# Altium project MB_SAUVC26.PrjPcb
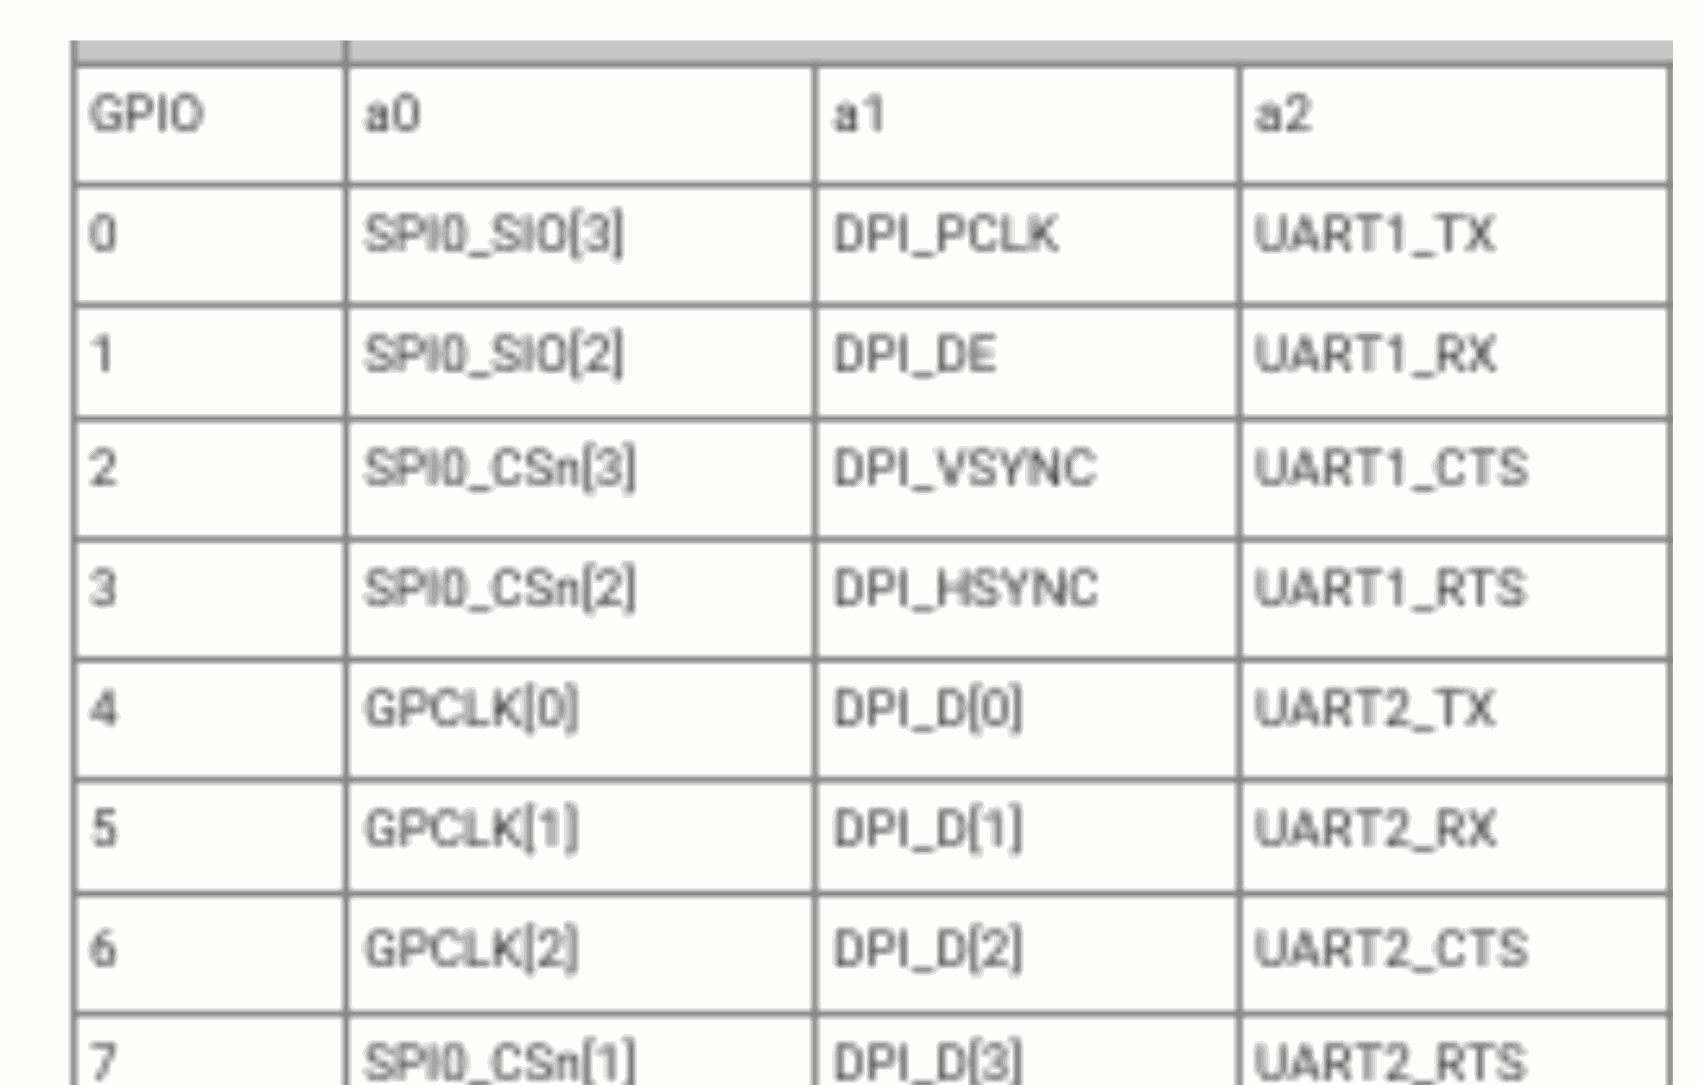
[diagram p0: Sheet1.SchDoc, top left]
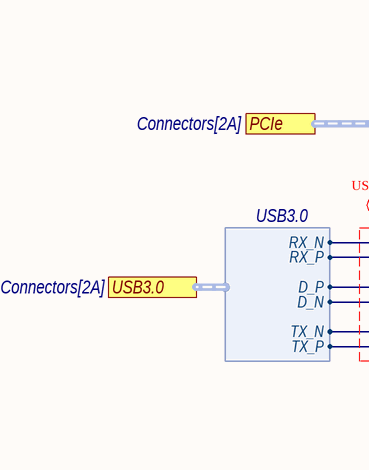
[diagram p1: Sheet1.SchDoc, top middle]
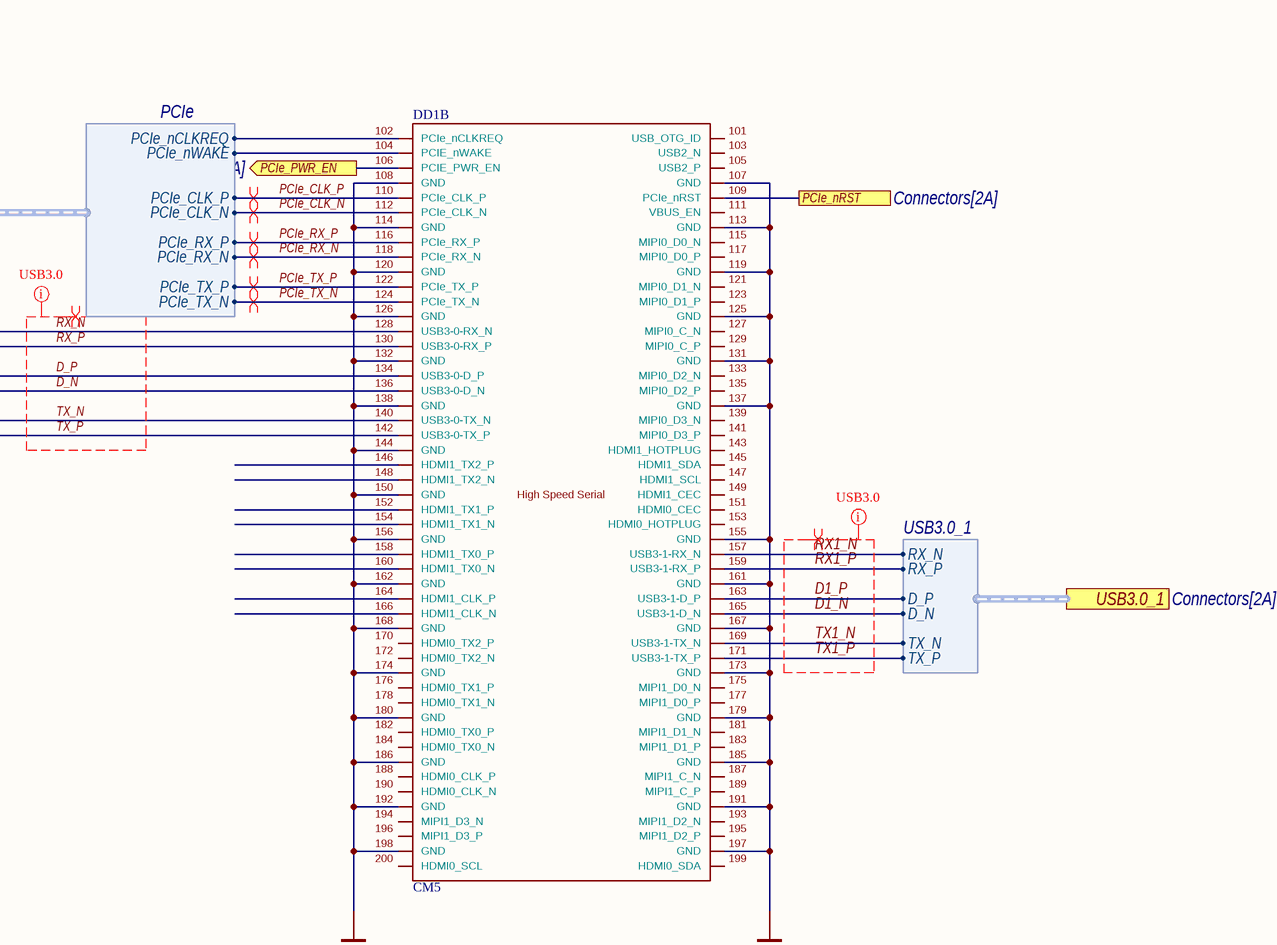
[diagram p2: Sheet1.SchDoc, top right]
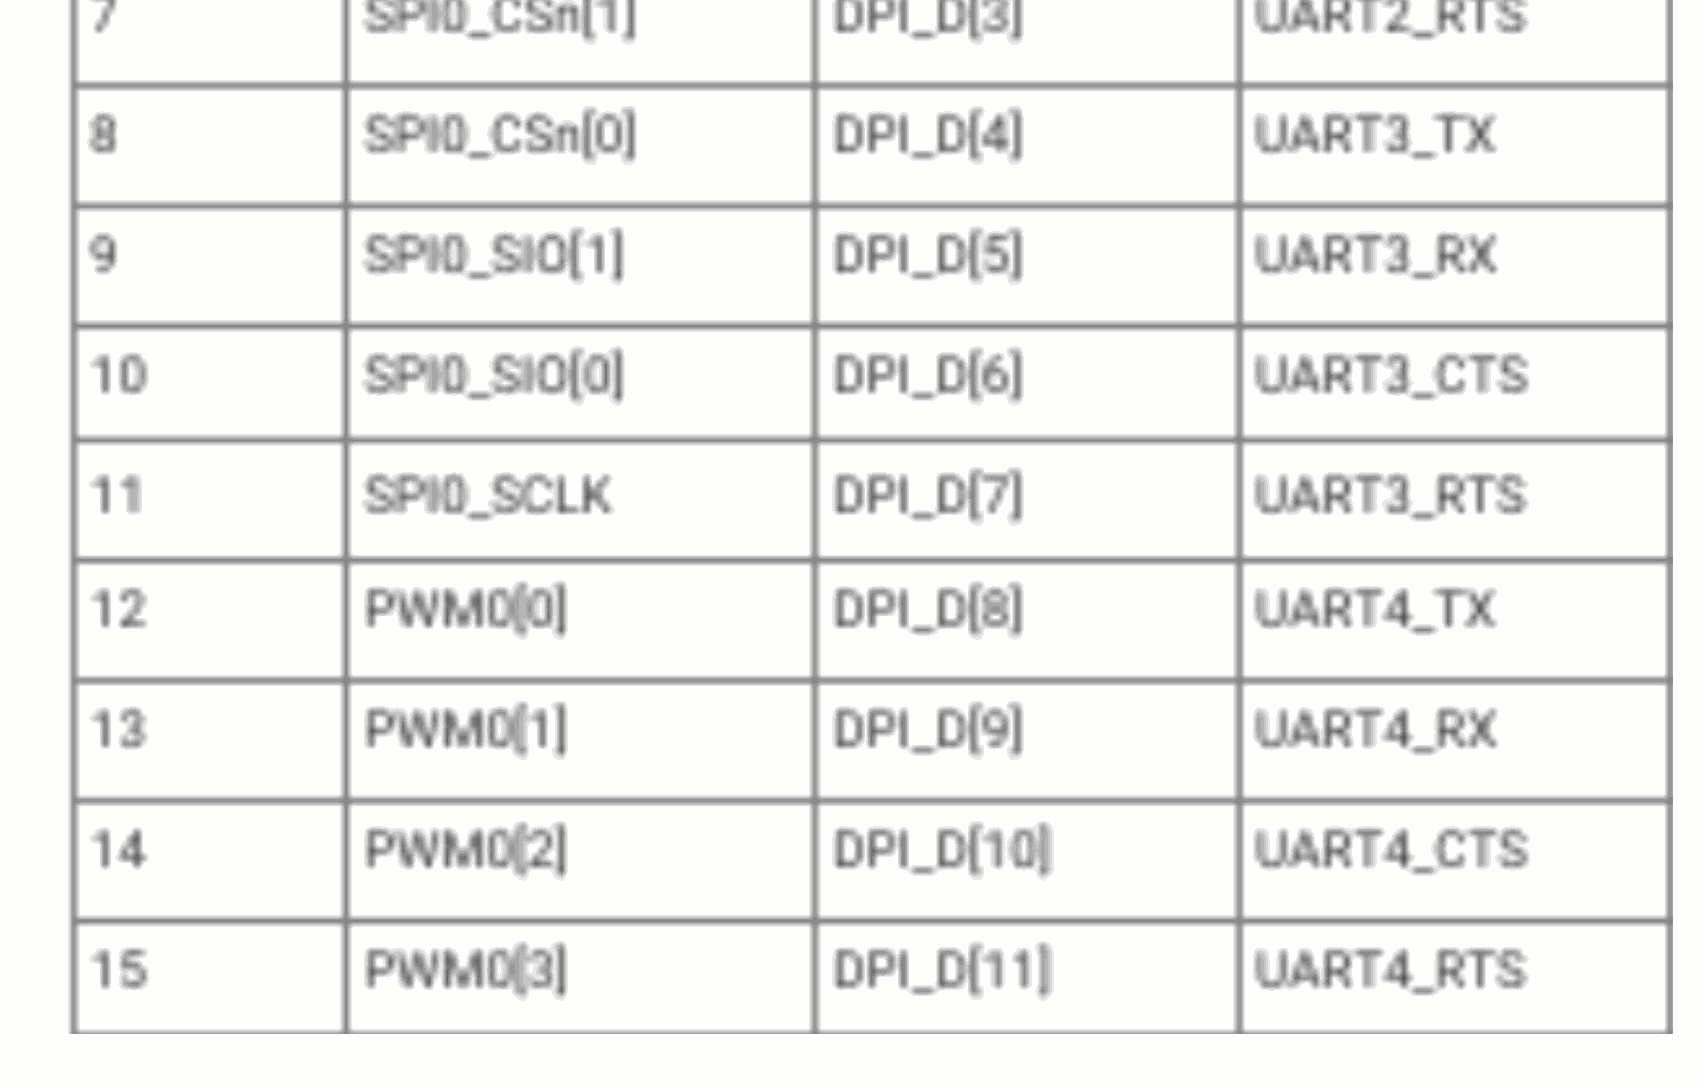
[diagram p3: Sheet1.SchDoc, bottom left]
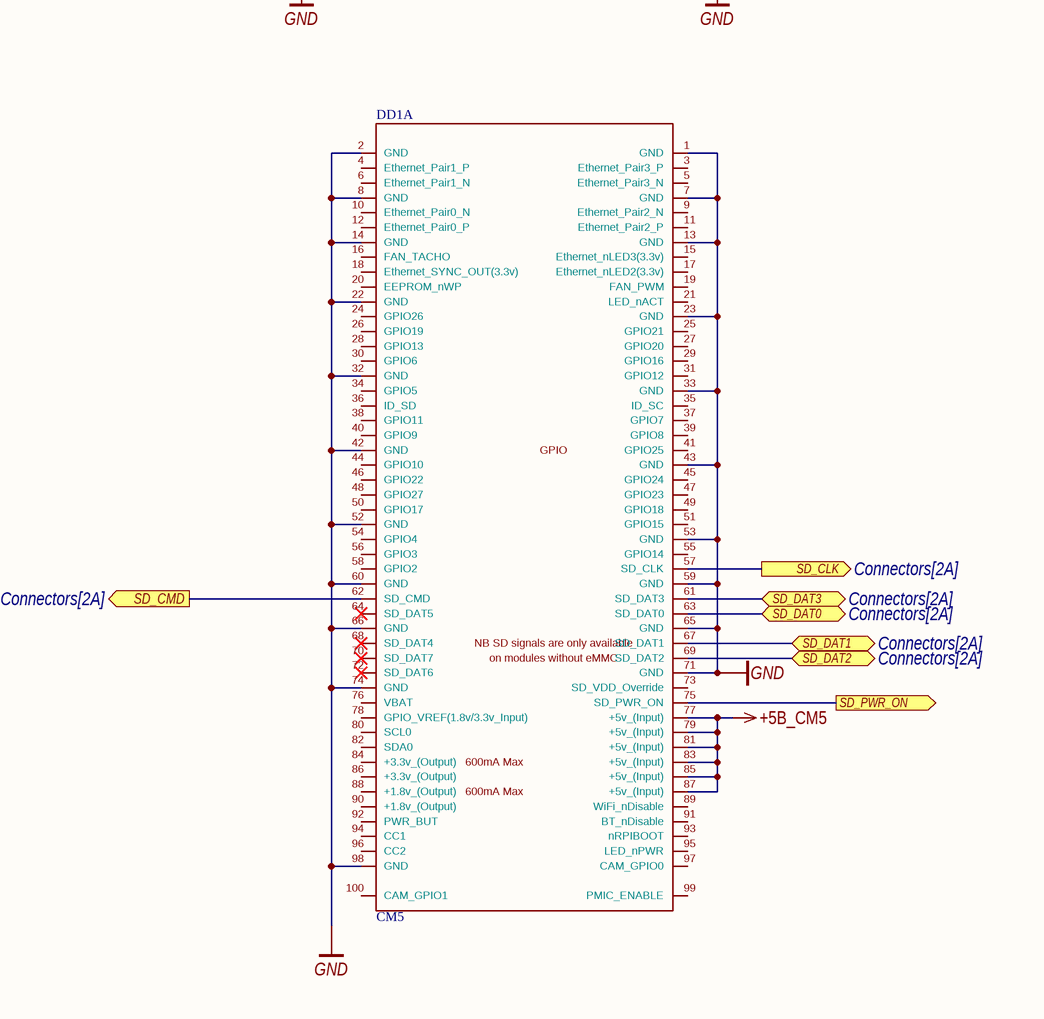
[diagram p4: Sheet1.SchDoc, bottom right]
Decimal_Number_PCB: ГИДР.123456.010; Decimal_Number_Shematic: ГИДР.123456.011; DrawnBy: Булатов и ко; Release_Date: 29.07.2025; Title: Материнская плата аппарата НеоВельт; Version: 03
4 sheets, 17 parts. Net scope: flat (ports and power ports of the same name join across sheets).
Board file: 4 layers.PcbDoc
Sheets:
  Sheet1.SchDoc
  Power.SchDoc
  ETH_SWITCH.SchDoc
  Connectors.SchDoc

## Sheet Sheet1.SchDoc: Материнская плата аппарата НеоВельт
size 594 x 420 mm; PageSetup: Record=PageOptions|CenterHorizontal=True|CenterVertical=True|PrintScale=0.94|XCorrection=1.00|YCorrection=1.00|PrintKind=1|BorderSize=5000000|LeftOffset=0|BottomOffset=0|Orientation=1|PaperLength=1000|PaperWidth=1000|Scale=100|PaperSource=7|PrintQuality=-4|MediaType=1|DitherType=10|PaperKind=A4|PrintScaleMode=1; Address1: Address1; Address2: Address2; Address3: Address3; Address4: Address4; DocumentNumber: 1; SheetNumber: 1; SheetTotal: 5

### Parts
DD1  CM5  [CM4-DF40HC(3.0)-100DS-0.4v_3mm_1.5mm]  (parts A,B of 2)

### Ports
PCIe (harness PCIe, see Connectors[2A]), PCIe_nRST (see Connectors[2A]), PCIe_PWR_EN (out, see Power[2A]), SD_CLK (out, see Connectors[2A]), SD_CMD (out, see Connectors[2A]), SD_DAT0 (bidir, see Connectors[2A]), SD_DAT1 (bidir, see Connectors[2A]), SD_DAT2 (bidir, see Connectors[2A]), SD_DAT3 (bidir, see Connectors[2A]), SD_PWR_ON (out), USB3.0 (harness USB3.0, see Connectors[2A]), USB3.0_1 (harness USB3.0_1, see Connectors[2A])

### Harnesses
USB3.0: RX_N, RX_P, D_P, D_N, TX_N, TX_P
USB3.0_1: RX_N, RX_P, D_P, D_N, TX_N, TX_P
PCIe: PCIe_nCLKREQ, PCIe_nWAKE, PCIe_CLK_P, PCIe_CLK_N, PCIe_RX_P, PCIe_RX_N, PCIe_TX_P, PCIe_TX_N

### Nets
+5В_CM5: DD1.77(+5v_(Input)) DD1.79(+5v_(Input)) DD1.81(+5v_(Input)) DD1.83(+5v_(Input)) DD1.85(+5v_(Input)) DD1.87(+5v_(Input))
GND: DD1.1(GND) DD1.2(GND) DD1.7(GND) DD1.8(GND) DD1.13(GND) DD1.14(GND) DD1.22(GND) DD1.23(GND) DD1.32(GND) DD1.33(GND) DD1.42(GND) DD1.43(GND) DD1.52(GND) DD1.53(GND) DD1.59(GND) DD1.60(GND) DD1.65(GND) DD1.66(GND) DD1.71(GND) DD1.74(GND) DD1.98(GND) DD1.107(GND) DD1.108(GND) DD1.113(GND) DD1.114(GND) DD1.119(GND) DD1.120(GND) DD1.125(GND) DD1.126(GND) DD1.131(GND) DD1.132(GND) DD1.137(GND) DD1.138(GND) DD1.144(GND) DD1.150(GND) DD1.155(GND) DD1.156(GND) DD1.161(GND) DD1.162(GND) DD1.167(GND) DD1.168(GND) DD1.173(GND) DD1.174(GND) DD1.179(GND) DD1.180(GND) DD1.185(GND) DD1.186(GND) DD1.191(GND) DD1.192(GND) DD1.197(GND) DD1.198(GND)
D1_N: DD1.165(USB3-1-D_N) ; port USB3.0_1.D_N
D1_P: DD1.163(USB3-1-D_P) ; port USB3.0_1.D_P
D_N: DD1.136(USB3-0-D_N) ; port USB3.0.D_N
D_P: DD1.134(USB3-0-D_P) ; port USB3.0.D_P
PCIe_CLK_N: DD1.112(PCIe_CLK_N) ; port PCIe.PCIe_CLK_N
PCIe_CLK_P: DD1.110(PCIe_CLK_P) ; port PCIe.PCIe_CLK_P
PCIe_RX_N: DD1.118(PCIe_RX_N) ; port PCIe.PCIe_RX_N
PCIe_RX_P: DD1.116(PCIe_RX_P) ; port PCIe.PCIe_RX_P
PCIe_TX_N: DD1.124(PCIe_TX_N) ; port PCIe.PCIe_TX_N
PCIe_TX_P: DD1.122(PCIe_TX_P) ; port PCIe.PCIe_TX_P
RX1_N: DD1.157(USB3-1-RX_N) ; port USB3.0_1.RX_N
RX1_P: DD1.159(USB3-1-RX_P) ; port USB3.0_1.RX_P
RX_N: DD1.128(USB3-0-RX_N) ; port USB3.0.RX_N
RX_P: DD1.130(USB3-0-RX_P) ; port USB3.0.RX_P
TX1_N: DD1.169(USB3-1-TX_N) ; port USB3.0_1.TX_N
TX1_P: DD1.171(USB3-1-TX_P) ; port USB3.0_1.TX_P
TX_N: DD1.140(USB3-0-TX_N) ; port USB3.0.TX_N
TX_P: DD1.142(USB3-0-TX_P) ; port USB3.0.TX_P
NetDD1_57: DD1.57(SD_CLK) ; port SD_CLK
NetDD1_61: DD1.61(SD_DAT3) ; port SD_DAT3
NetDD1_62: DD1.62(SD_CMD) ; port SD_CMD
NetDD1_63: DD1.63(SD_DAT0) ; port SD_DAT0
NetDD1_67: DD1.67(SD_DAT1) ; port SD_DAT1
NetDD1_69: DD1.69(SD_DAT2) ; port SD_DAT2
NetDD1_75: DD1.75(SD_PWR_ON) ; port SD_PWR_ON
NetDD1_102: DD1.102(PCIe_nCLKREQ) ; port PCIe.PCIe_nCLKREQ
NetDD1_104: DD1.104(PCIE_nWAKE) ; port PCIe.PCIe_nWAKE
NetDD1_106: DD1.106(PCIE_PWR_EN) ; port PCIe_PWR_EN
NetDD1_109: DD1.109(PCIe_nRST) ; port PCIe_nRST

Not connected (* = marked no-connect by the designer): DD1 3(Ethernet_Pair3_P) 4(Ethernet_Pair1_P) 5(Ethernet_Pair3_N) 6(Ethernet_Pair1_N) 9(Ethernet_Pair2_N) 10(Ethernet_Pair0_N) 11(Ethernet_Pair2_P) 12(Ethernet_Pair0_P) 15(Ethernet_nLED3(3.3v)) 16(FAN_TACHO) 17(Ethernet_nLED2(3.3v)) 18(Ethernet_SYNC_OUT(3.3v)) 19(FAN_PWM) 20(EEPROM_nWP) 21(LED_nACT) 24(GPIO26) 25(GPIO21) 26(GPIO19) 27(GPIO20) 28(GPIO13) 29(GPIO16) 30(GPIO6) 31(GPIO12) 34(GPIO5) 35(ID_SC) 36(ID_SD) 37(GPIO7) 38(GPIO11) 39(GPIO8) 40(GPIO9) 41(GPIO25) 44(GPIO10) 45(GPIO24) 46(GPIO22) 47(GPIO23) 48(GPIO27) 49(GPIO18) 50(GPIO17) 51(GPIO15) 54(GPIO4) 55(GPIO14) 56(GPIO3) 58(GPIO2) 64(SD_DAT5)* 68(SD_DAT4)* 70(SD_DAT7)* 72(SD_DAT6)* 73(SD_VDD_Override) 76(VBAT) 78(GPIO_VREF(1.8v/3.3v_Input)) 80(SCL0) 82(SDA0) 84(+3.3v_(Output)) 86(+3.3v_(Output)) 88(+1.8v_(Output)) 89(WiFi_nDisable) 90(+1.8v_(Output)) 91(BT_nDisable) 92(PWR_BUT) 93(nRPIBOOT) 94(CC1) 95(LED_nPWR) 96(CC2) 97(CAM_GPIO0) 99(PMIC_ENABLE) 100(CAM_GPIO1) 101(USB_OTG_ID) 103(USB2_N) 105(USB2_P) 111(VBUS_EN) 115(MIPI0_D0_N) 117(MIPI0_D0_P) 121(MIPI0_D1_N) 123(MIPI0_D1_P) 127(MIPI0_C_N) 129(MIPI0_C_P) 133(MIPI0_D2_N) 135(MIPI0_D2_P) 139(MIPI0_D3_N) 141(MIPI0_D3_P) 143(HDMI1_HOTPLUG) 145(HDMI1_SDA) 146(HDMI1_TX2_P) 147(HDMI1_SCL) 148(HDMI1_TX2_N) 149(HDMI1_CEC) 151(HDMI0_CEC) 152(HDMI1_TX1_P) 153(HDMI0_HOTPLUG) 154(HDMI1_TX1_N) 158(HDMI1_TX0_P) 160(HDMI1_TX0_N) 164(HDMI1_CLK_P) 166(HDMI1_CLK_N) 170(HDMI0_TX2_P) 172(HDMI0_TX2_N) 175(MIPI1_D0_N) 176(HDMI0_TX1_P) 177(MIPI1_D0_P) 178(HDMI0_TX1_N) 181(MIPI1_D1_N) 182(HDMI0_TX0_P) 183(MIPI1_D1_P) 184(HDMI0_TX0_N) 187(MIPI1_C_N) 188(HDMI0_CLK_P) 189(MIPI1_C_P) 190(HDMI0_CLK_N) 193(MIPI1_D2_N) 194(MIPI1_D3_N) 195(MIPI1_D2_P) 196(MIPI1_D3_P) 199(HDMI0_SDA) 200(HDMI0_SCL)

### Layout directives
differential pair: D1_N, D1_P, D_N, D_P, PCIe_CLK_N, PCIe_CLK_P, PCIe_RX_N, PCIe_RX_P, PCIe_TX_N, PCIe_TX_P, RX1_N, RX1_P, RX_N, RX_P, TX1_N, TX1_P, TX_N, TX_P
net class USB3.0; Impedance: 90 Ohm: D1_N, D1_P, D_N, D_P, RX1_N, RX1_P, RX_N, RX_P, TX1_N, TX1_P, TX_N, TX_P

### Notes on the sheet
- Перв. примен.
- Справ. №
- Подп. и дата
- Инв. № дубл.
- Взам. инв. №
- Инв. № подл.
- Изм.
- Лист
- № докум.
- Подп.
- Дата
- Копировал
- Формат А2
- (in symbol CM5, part A) GPIO; NB SD signals are only available; on modules without eMMC; 600mA Max
- (in symbol CM5, part B) High Speed Serial

### Library data of the parts
DD1 = CM5: Part Number: CM5

## Sheet Power.SchDoc: Материнская плата аппарата НеоВельт
size 420 x 297 mm; PageSetup: Record=PageOptions|CenterHorizontal=True|CenterVertical=True|PrintScale=0.94|XCorrection=1.00|YCorrection=1.00|PrintKind=1|BorderSize=5000000|LeftOffset=0|BottomOffset=0|Orientation=1|PaperLength=1000|PaperWidth=1000|Scale=100|PaperSource=7|PrintQuality=-4|MediaType=1|DitherType=10|PaperKind=A4|PrintScaleMode=1; Address1: Address1; Address2: Address2; Address3: Address3; Address4: Address4; DocumentNumber: 2; SheetNumber: 2; SheetTotal: 5
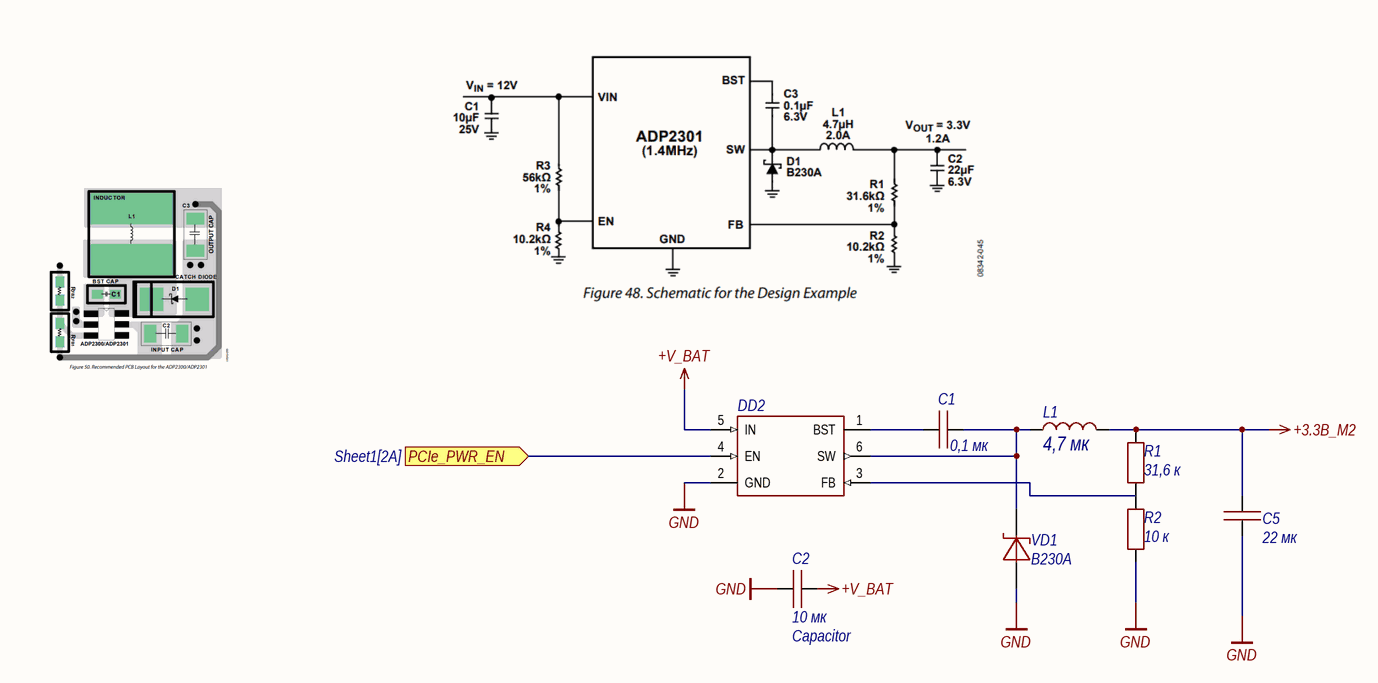
[diagram p5: Power.SchDoc]

### Parts
C1  value 0,1 мк  [0603C]  (hidden comment: Capacitor)
C2  Capacitor  value 10 мк  [1210C]
C5  value 22 мк  [1210C]  (hidden comment: Capacitor)
DD2  Повышающий DC-DC преобразователь 2А 1.2МГц  (value not drawn)
L1  value 4,7 мк  [IHLP-2525]  (hidden comment: IHLP2525CZER4R7M01)
R1  value 31,6 к  [0603R]  (hidden comment: Resistor)
R2  value 10 к  [0603R]  (hidden comment: Resistor)
VD1  B230A  [SMA]

### Ports
PCIe_PWR_EN (in, see Sheet1[2A])

### Nets
+3.3В_M2: C5.2 L1.2 R1.1
+V_BAT: C2.2 DD2.5(IN)
GND: C2.1 C5.1 DD2.2(GND) R2.1 VD1.1
NetC1_1: C1.1 DD2.1(BST)
NetC1_2: C1.2 DD2.6(SW) L1.1 VD1.2
NetDD1_106: DD2.4(EN) ; port PCIe_PWR_EN
NetDD2_3: DD2.3(FB) R1.2 R2.2

### Notes on the sheet
- Перв. примен.
- Справ. №
- Подп. и дата
- Инв. № дубл.
- Взам. инв. №
- Инв. № подл.
- Изм.
- Лист
- № докум.
- Подп.
- Дата
- Копировал
- Формат А3

### Library data of the parts
C1 = Capacitor_0,1u_10_50V_X7R_0603C: Конденсатор; Library Path2: Schematic\Capacitor.SchLib; Tolerance: 0,1; Voltage (V): 50; Dielectric: X7R; Capacity (nF): 100; Part Number: Capacitor_0,1u_10_50V_X7R_0603C
C2 = Capacitor_10u_10_35V_X7R_1210C: Конденсатор; Library Path2: Schematic\Capacitor.SchLib; Tolerance: 0,1; Voltage (V): 35; Dielectric: X7R; Capacity (nF): 10000; Part Number: Capacitor_10u_10_35V_X7R_1210C
C5 = Capacitor_22u_10_25V_X7R_1210C: Конденсатор; Library Path2: Schematic\Capacitor.SchLib; Tolerance: 0,1; Voltage (V): 25; Dielectric: X7R; Capacity (nF): 22000; Part Number: Capacitor_22u_10_25V_X7R_1210C
DD2 = ADP2300
L1 = IHLP2525CZER4R7M01: ЧИП-индуктивность экранированная 4,7мкГн ±20% 5,5A 40мОм 2525; Inductance (μH): 4,7; Current (A): 5,5; Part Number: IHLP2525CZER4R7M01
R1 = Resistor_31.6k_1_0603: Резистор номиналом 31,6 кОм и точностью 1%; Power: *; Part Number: Resistor_31.6k_1_0603; Tolerance: 1%
R2 = Resistor_10k_1_0603: Резистор номиналом 10 кОм и точностью 1%; Power: *; Part Number: Resistor_10k_1_0603; Tolerance: 1%
VD1 = 15MQ040N: Диод шоттки на 40 В, ном. ток 2.1 А; Voltage nominal (V): 40; Current (A): 2.1; Part Number: 15MQ040N

## Sheet ETH_SWITCH.SchDoc: Материнская плата аппарата НеоВельт
size 594 x 420 mm; PageSetup: Record=PageOptions|CenterHorizontal=True|CenterVertical=True|PrintScale=0.94|XCorrection=1.00|YCorrection=1.00|PrintKind=1|BorderSize=5000000|LeftOffset=0|BottomOffset=0|Orientation=1|PaperLength=1000|PaperWidth=1000|Scale=100|PaperSource=7|PrintQuality=-4|MediaType=1|DitherType=10|PaperKind=A4|PrintScaleMode=1; Address1: Address1; Address2: Address2; Address3: Address3; Address4: Address4; DocumentNumber: 3; SheetNumber: 3; SheetTotal: 5
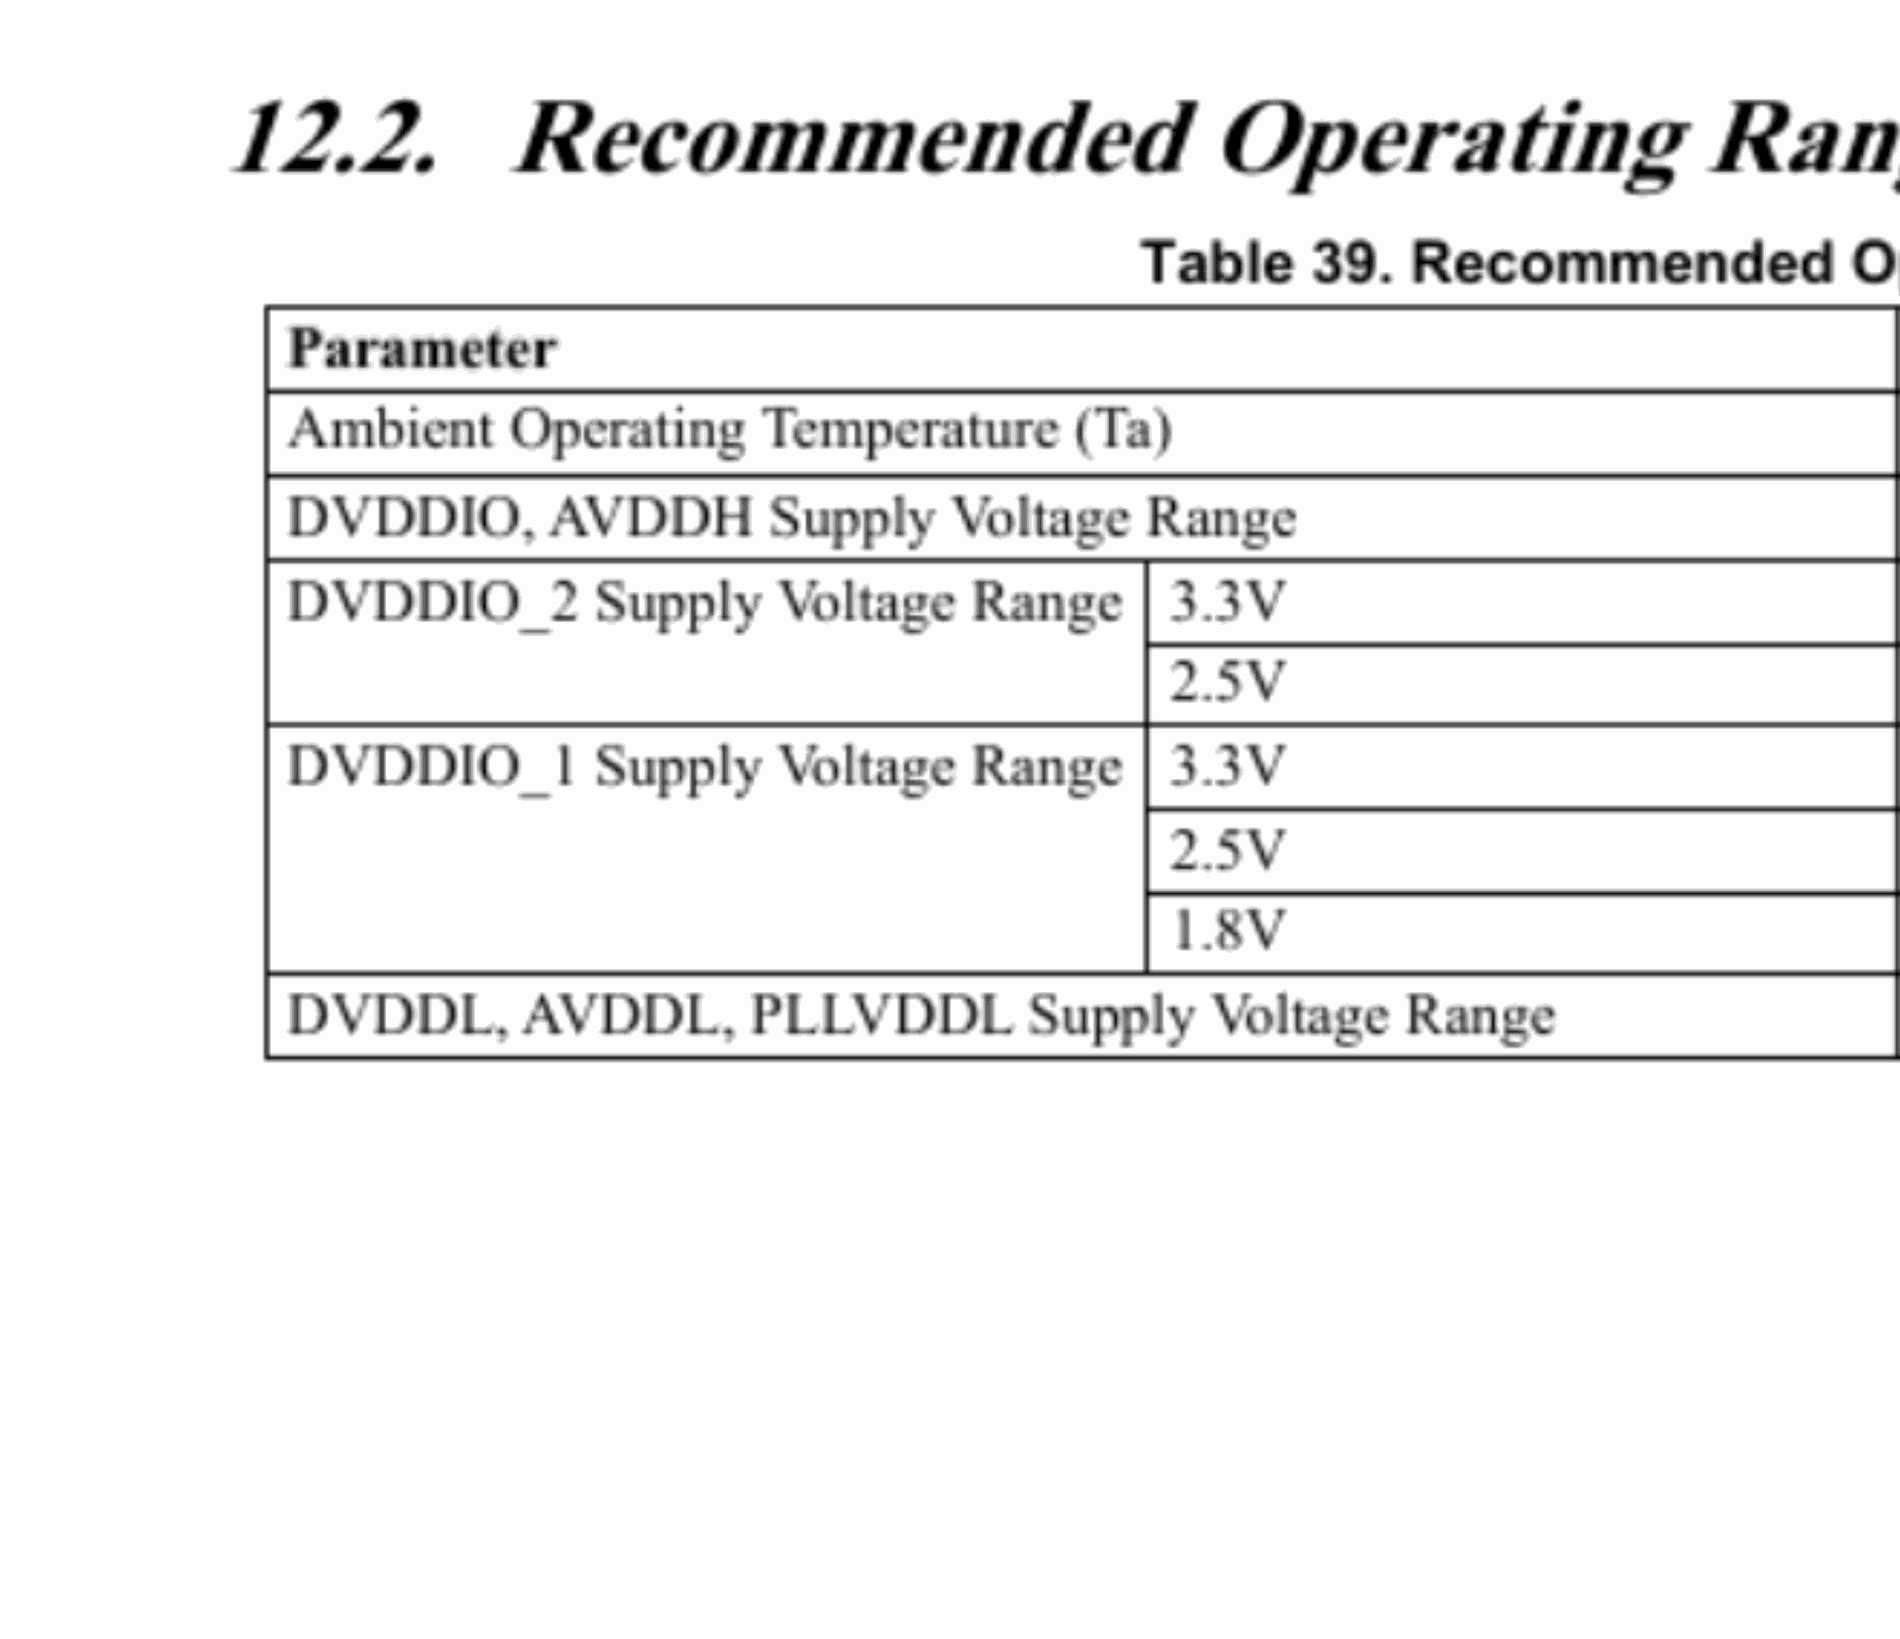
[diagram p6: ETH_SWITCH.SchDoc, top left]
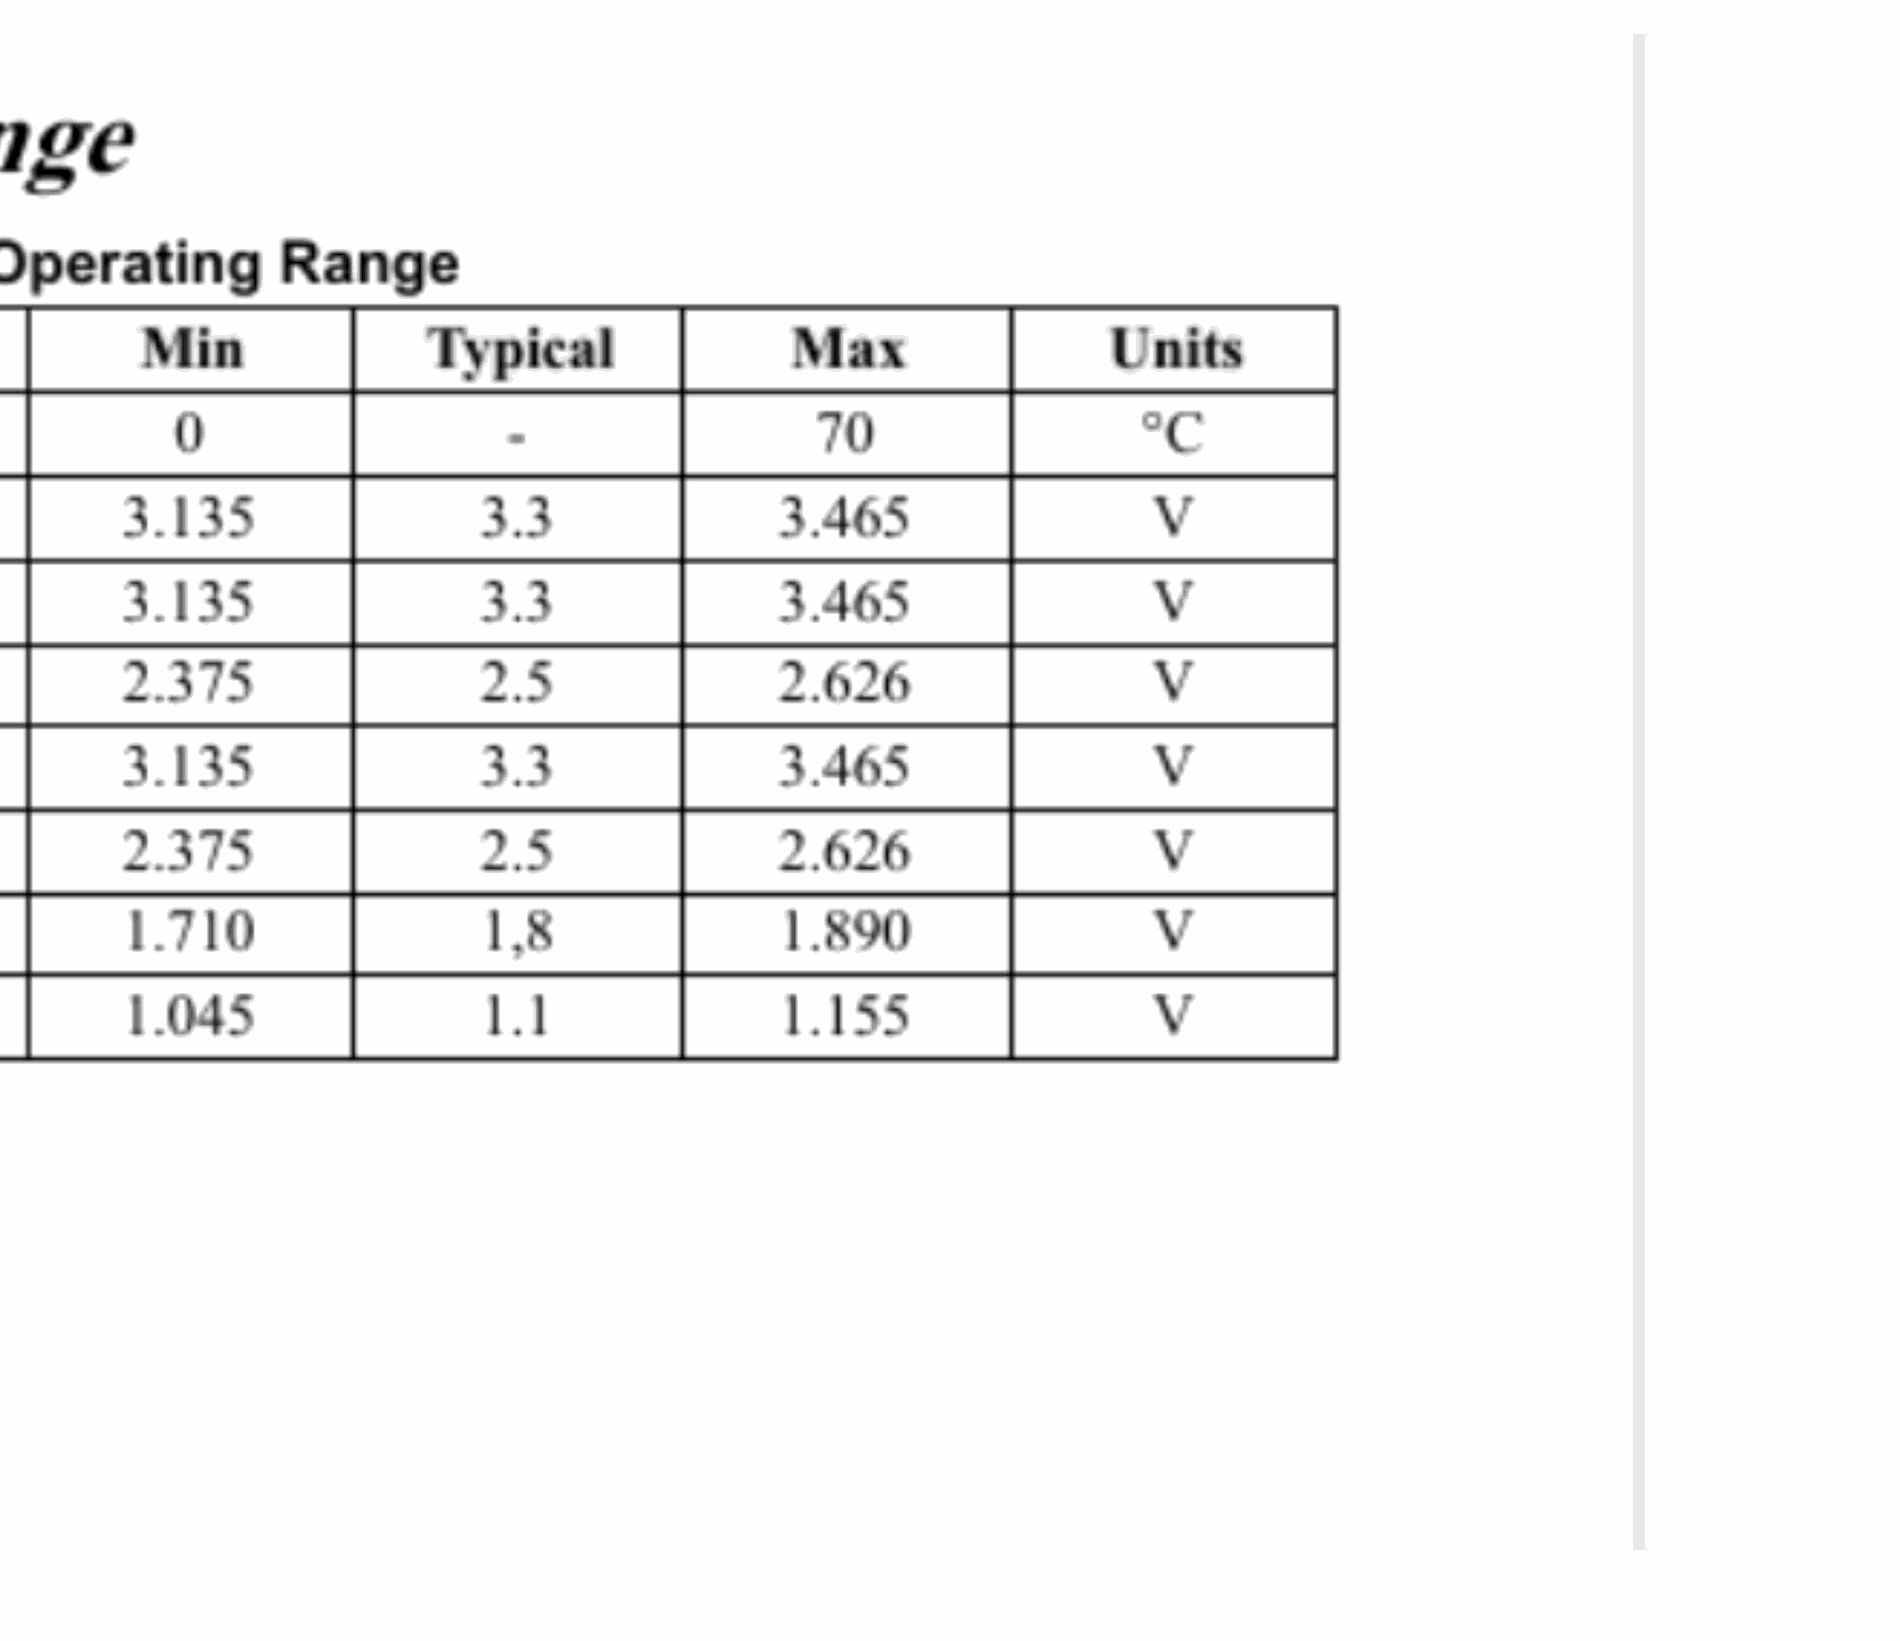
[diagram p7: ETH_SWITCH.SchDoc, top right]
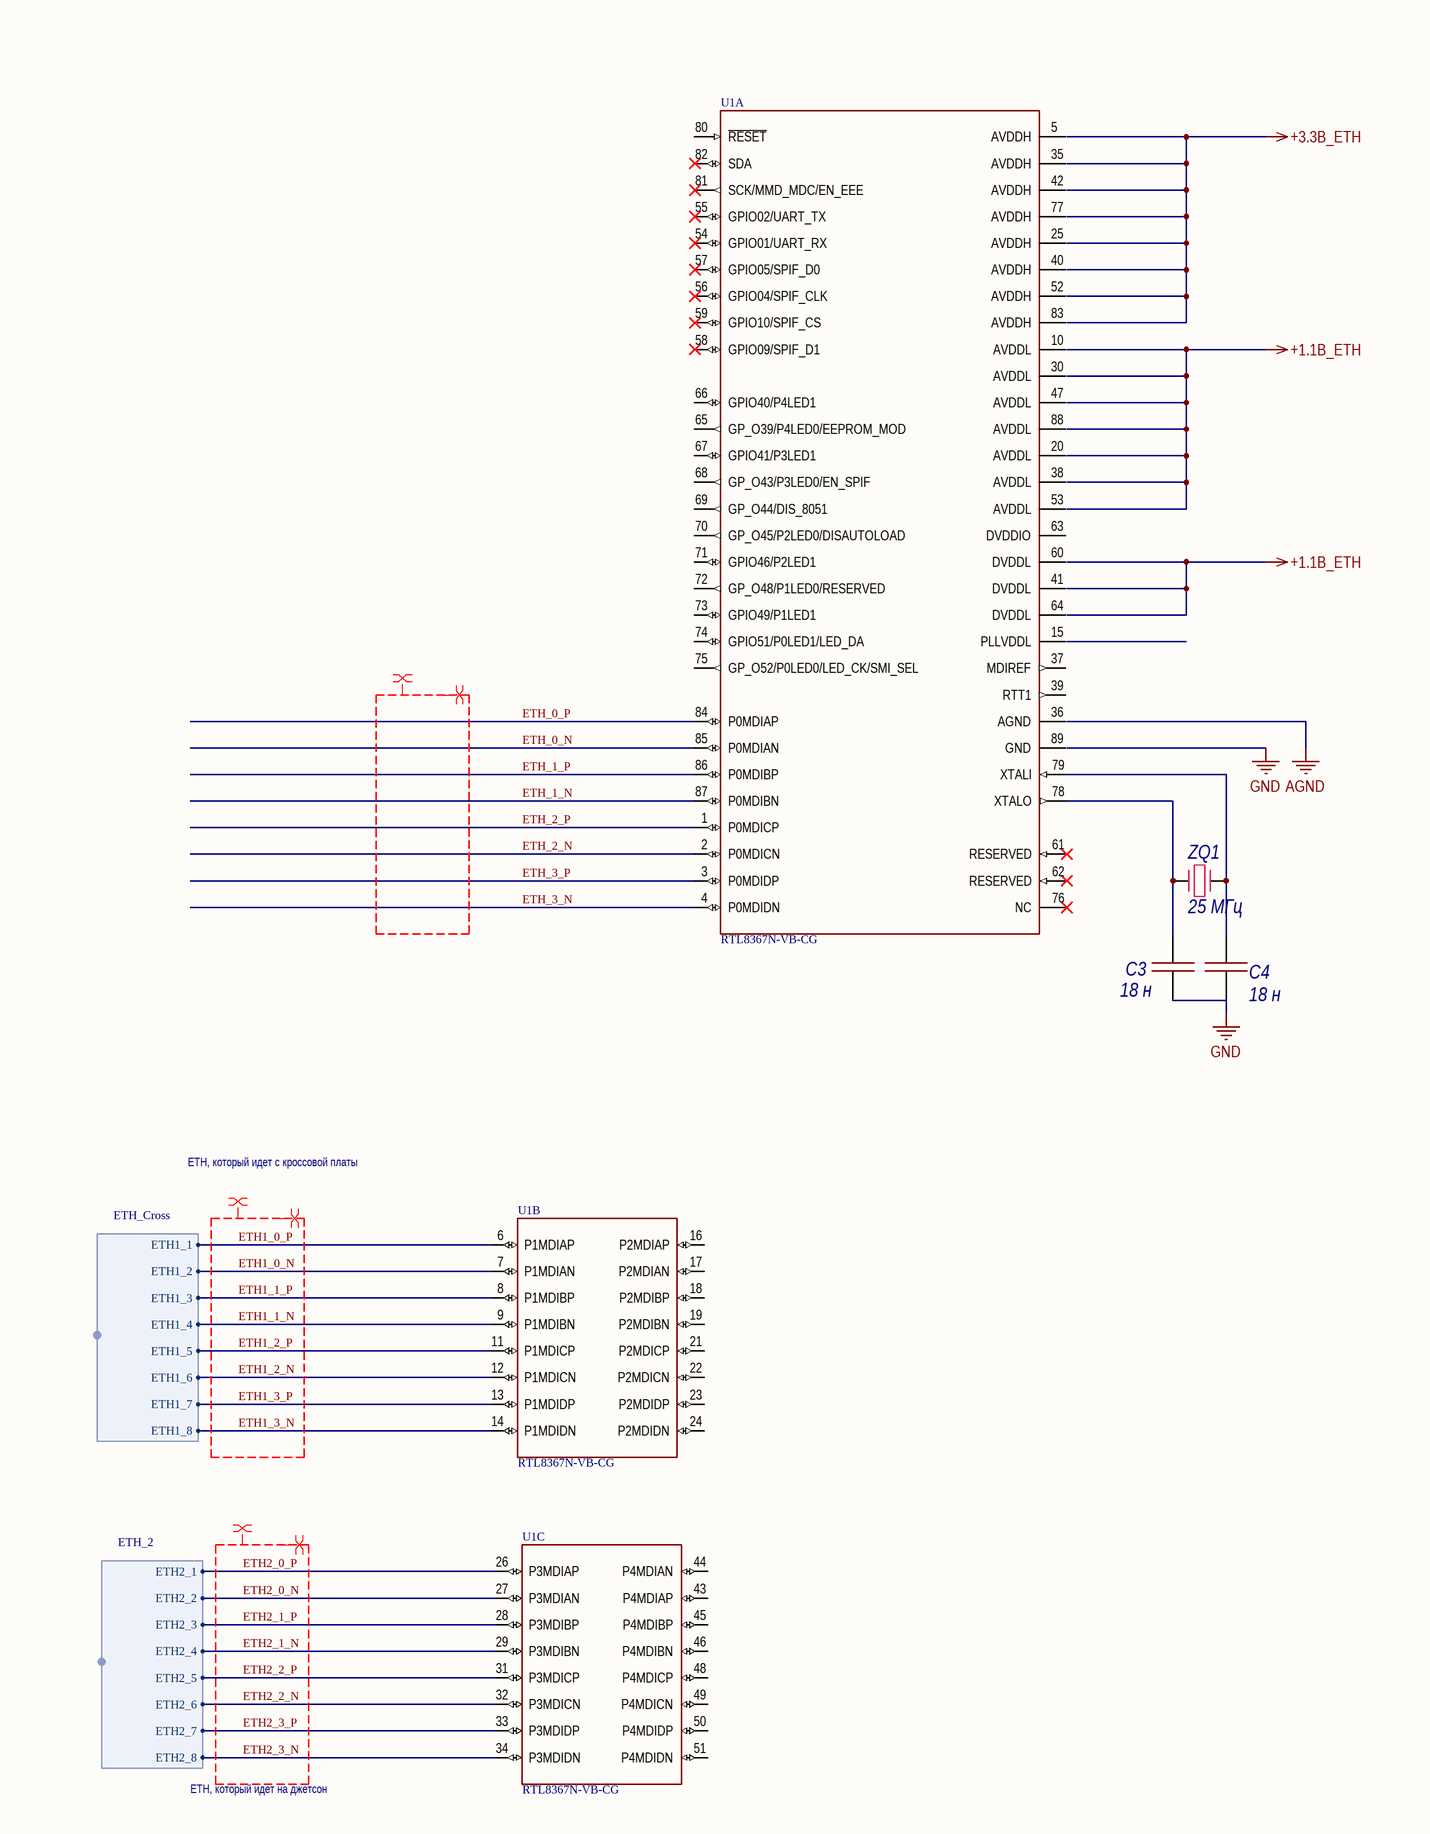
[diagram p8: ETH_SWITCH.SchDoc, bottom left]

### Parts
C3  value 18 н  [0603C]  (hidden comment: Capacitor)
C4  value 18 н  [0603C]  (hidden comment: Capacitor)
U1  RTL8367N-VB-CG  [QFN40]  (parts A,B,C of 3)
ZQ1  value 25 МГц  [HC49SD]  (hidden comment: XTAL)

### Harnesses
ETH_Cross: ETH1_1, ETH1_2, ETH1_3, ETH1_4, ETH1_5, ETH1_6, ETH1_7, ETH1_8
ETH_2: ETH2_1, ETH2_2, ETH2_3, ETH2_4, ETH2_5, ETH2_6, ETH2_7, ETH2_8

### Nets
GND: C3.1 C4.2
ETH1_0_N: U1.7(P1MDIAN) ; harness ETH_Cross.ETH1_2
ETH1_0_P: U1.6(P1MDIAP) ; harness ETH_Cross.ETH1_1
ETH1_1_N: U1.9(P1MDIBN) ; harness ETH_Cross.ETH1_4
ETH1_1_P: U1.8(P1MDIBP) ; harness ETH_Cross.ETH1_3
ETH1_2_N: U1.12(P1MDICN) ; harness ETH_Cross.ETH1_6
ETH1_2_P: U1.11(P1MDICP) ; harness ETH_Cross.ETH1_5
ETH1_3_N: U1.14(P1MDIDN) ; harness ETH_Cross.ETH1_8
ETH1_3_P: U1.13(P1MDIDP) ; harness ETH_Cross.ETH1_7
ETH2_0_N: U1.27(P3MDIAN) ; harness ETH_2.ETH2_2
ETH2_0_P: U1.26(P3MDIAP) ; harness ETH_2.ETH2_1
ETH2_1_N: U1.29(P3MDIBN) ; harness ETH_2.ETH2_4
ETH2_1_P: U1.28(P3MDIBP) ; harness ETH_2.ETH2_3
ETH2_2_N: U1.32(P3MDICN) ; harness ETH_2.ETH2_6
ETH2_2_P: U1.31(P3MDICP) ; harness ETH_2.ETH2_5
ETH2_3_N: U1.34(P3MDIDN) ; harness ETH_2.ETH2_8
ETH2_3_P: U1.33(P3MDIDP) ; harness ETH_2.ETH2_7
ETH_0_N: U1.85(P0MDIAN)
ETH_0_P: U1.84(P0MDIAP)
ETH_1_N: U1.87(P0MDIBN)
ETH_1_P: U1.86(P0MDIBP)
ETH_2_N: U1.2(P0MDICN)
ETH_2_P: U1.1(P0MDICP)
ETH_3_N: U1.4(P0MDIDN)
ETH_3_P: U1.3(P0MDIDP)
NetC3_2: C3.2 U1.78(XTALO) ZQ1.1
NetC4_1: C4.1 U1.79(XTALI) ZQ1.2

Not connected (* = marked no-connect by the designer): U1 5(AVDDH) 10(AVDDL) 15(PLLVDDL) 16(P2MDIAP) 17(P2MDIAN) 18(P2MDIBP) 19(P2MDIBN) 20(AVDDL) 21(P2MDICP) 22(P2MDICN) 23(P2MDIDP) 24(P2MDIDN) 25(AVDDH) 30(AVDDL) 35(AVDDH) 36(AGND) 37(MDIREF) 38(AVDDL) 39(RTT1) 40(AVDDH) 41(DVDDL) 42(AVDDH) 43(P4MDIAP) 44(P4MDIAN) 45(P4MDIBP) 46(P4MDIBN) 47(AVDDL) 48(P4MDICP) 49(P4MDICN) 50(P4MDIDP) 51(P4MDIDN) 52(AVDDH) 53(AVDDL) 54(GPIO01/UART_RX) 55(GPIO02/UART_TX) 56(GPIO04/SPIF_CLK) 57(GPIO05/SPIF_D0) 58(GPIO09/SPIF_D1) 59(GPIO10/SPIF_CS) 60(DVDDL) 61(RESERVED)* 62(RESERVED)* 63(DVDDIO) 64(DVDDL) 65(GP_O39/P4LED0/EEPROM_MOD) 66(GPIO40/P4LED1) 67(GPIO41/P3LED1) 68(GP_O43/P3LED0/EN_SPIF) 69(GP_O44/DIS_8051) 70(GP_O45/P2LED0/DISAUTOLOAD) 71(GPIO46/P2LED1) 72(GP_O48/P1LED0/RESERVED) 73(GPIO49/P1LED1) 74(GPIO51/P0LED1/LED_DA) 75(GP_O52/P0LED0/LED_CK/SMI_SEL) 76(NC)* 77(AVDDH) 80(~{RESET}) 81(SCK/MMD_MDC/EN_EEE) 82(SDA) 83(AVDDH) 88(AVDDL) 89(GND)

### Layout directives
differential pair: (no net found under the mark), ETH1_0_N, ETH1_0_P, ETH1_1_N, ETH1_1_P, ETH1_2_N, ETH1_2_P, ETH1_3_N, ETH1_3_P, ETH2_0_N, ETH2_0_P, ETH2_1_N, ETH2_1_P, ETH2_2_N, ETH2_2_P, ETH2_3_N, ETH2_3_P
Impedance: 100 Ohm; net class Ethernet: (no net found under the mark), ETH1_0_N, ETH1_0_P, ETH1_1_N, ETH1_1_P, ETH1_2_N, ETH1_2_P, ETH1_3_N, ETH1_3_P, ETH2_0_N, ETH2_0_P, ETH2_1_N, ETH2_1_P, ETH2_2_N, ETH2_2_P, ETH2_3_N, ETH2_3_P

### Notes on the sheet
- ETH, который идет с кроссовой платы
- ETH, который идет на джетсон
- Перв. примен.
- Справ. №
- Подп. и дата
- Инв. № дубл.
- Взам. инв. №
- Инв. № подл.
- Изм.
- Лист
- № докум.
- Подп.
- Дата
- Копировал
- Формат А2

### Library data of the parts
C3 C4 = Capacitor_18n_10_50V_X7R_0603C: Конденсатор; Tolerance: 0,1; Voltage (V): 50; Dielectric: X7R; Capacity (nF): 18; Part Number: Capacitor_18n_10_50V_X7R_0603C
U1 = RTL8367N-VB-CG: MF: Realtek; Package: None; Price: None; Value: *; MP: RTL8367N-VB-CG; Availability: Unavailable; Part Number: RTL8367N-VB-CG
ZQ1 = XTAL: Кварцевый резонатор; Part Number: XTAL

## Sheet Connectors.SchDoc: Материнская плата аппарата НеоВельт
size 594 x 420 mm; PageSetup: Record=PageOptions|CenterHorizontal=True|CenterVertical=True|PrintScale=0.94|XCorrection=1.00|YCorrection=1.00|PrintKind=1|BorderSize=5000000|LeftOffset=0|BottomOffset=0|Orientation=1|PaperLength=1000|PaperWidth=1000|Scale=100|PaperSource=7|PrintQuality=-4|MediaType=1|DitherType=10|PaperKind=A4|PrintScaleMode=1; Address1: Address1; Address2: Address2; Address3: Address3; Address4: Address4; DocumentNumber: 5; SheetNumber: 5; SheetTotal: 5
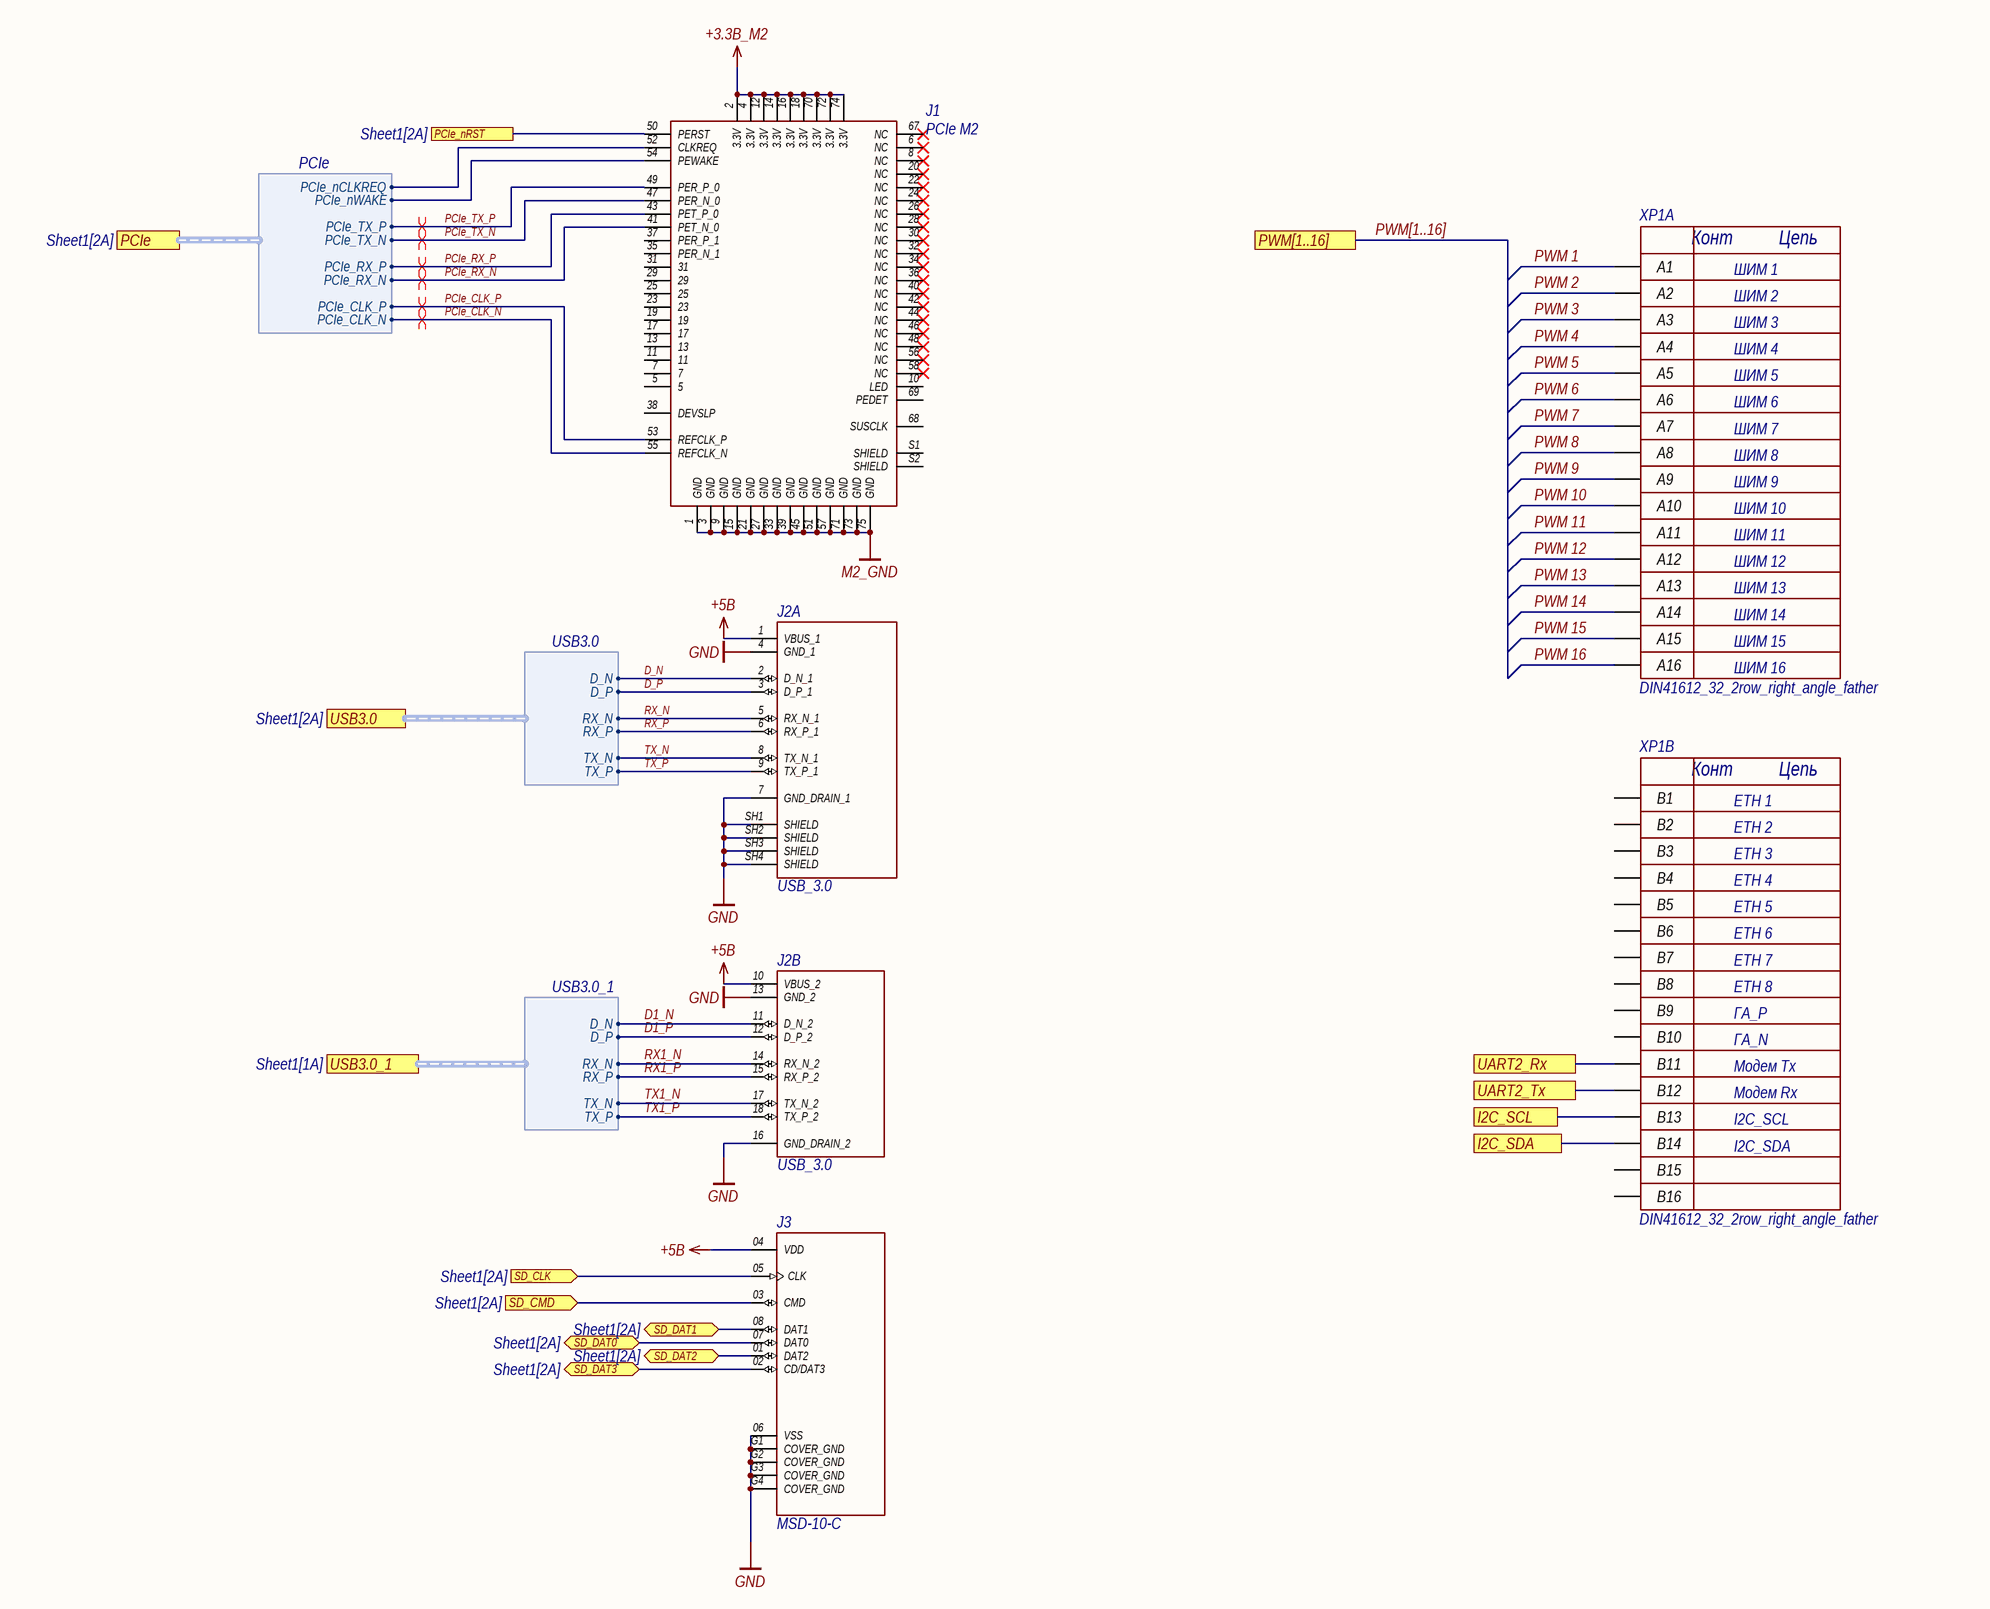
[diagram p9: Connectors.SchDoc]

### Parts
J1  PCIe M2  [PCIe M2]
J2  USB_3.0  [USB_3.0]  (parts A,B of 2)
J3  MSD-10-C  [CUI_MSD-10-C]
XP1  DIN41612_32_2row_right_angle_father  [DIN41612_32_2row_right_angle_father]  (parts A,B of 2)

### Ports
I2C_SCL, I2C_SDA, PCIe (harness PCIe, see Sheet1[2A]), PCIe_nRST (see Sheet1[2A]), PWM[1..16], SD_CLK (in, see Sheet1[2A]), SD_CMD (in, see Sheet1[2A]), SD_DAT0 (bidir, see Sheet1[2A]), SD_DAT1 (bidir, see Sheet1[2A]), SD_DAT2 (bidir, see Sheet1[2A]), SD_DAT3 (bidir, see Sheet1[2A]), UART2_Rx, UART2_Tx, USB3.0 (harness USB3.0, see Sheet1[2A]), USB3.0_1 (harness USB3.0_1, see Sheet1[1A])

### Harnesses
USB3.0: RX_N, RX_P, D_P, D_N, TX_N, TX_P
PCIe: PCIe_nCLKREQ, PCIe_nWAKE, PCIe_CLK_P, PCIe_CLK_N, PCIe_RX_P, PCIe_RX_N, PCIe_TX_P, PCIe_TX_N
USB3.0_1: RX_N, RX_P, D_P, D_N, TX_N, TX_P

### Nets
+3.3В_M2: J1.2(3.3V) J1.4(3.3V) J1.12(3.3V) J1.14(3.3V) J1.16(3.3V) J1.18(3.3V) J1.70(3.3V) J1.72(3.3V) J1.74(3.3V)
+5В: J2.1(VBUS_1) J2.10(VBUS_2) J3.04(VDD)
GND: J2.4(GND_1) J2.7(GND_DRAIN_1) J2.13(GND_2) J2.16(GND_DRAIN_2) J2.SH1(SHIELD) J2.SH2(SHIELD) J2.SH3(SHIELD) J2.SH4(SHIELD) J3.06(VSS) J3.G1(COVER_GND) J3.G2(COVER_GND) J3.G3(COVER_GND) J3.G4(COVER_GND)
M2_GND: J1.1(GND) J1.3(GND) J1.9(GND) J1.15(GND) J1.21(GND) J1.27(GND) J1.33(GND) J1.39(GND) J1.45(GND) J1.51(GND) J1.57(GND) J1.71(GND) J1.73(GND) J1.75(GND)
D1_N: J2.11(D_N_2) ; port USB3.0_1.D_N
D1_P: J2.12(D_P_2) ; port USB3.0_1.D_P
D_N: J2.2(D_N_1) ; port USB3.0.D_N
D_P: J2.3(D_P_1) ; port USB3.0.D_P
PCIe_CLK_N: J1.55(REFCLK_N) ; port PCIe.PCIe_CLK_N
PCIe_CLK_P: J1.53(REFCLK_P) ; port PCIe.PCIe_CLK_P
PCIe_RX_N: J1.41(PET_N_0) ; port PCIe.PCIe_RX_N
PCIe_RX_P: J1.43(PET_P_0) ; port PCIe.PCIe_RX_P
PCIe_TX_N: J1.47(PER_N_0) ; port PCIe.PCIe_TX_N
PCIe_TX_P: J1.49(PER_P_0) ; port PCIe.PCIe_TX_P
PWM 1: XP1.A1
PWM 2: XP1.A2
PWM 3: XP1.A3
PWM 4: XP1.A4
PWM 5: XP1.A5
PWM 6: XP1.A6
PWM 7: XP1.A7
PWM 8: XP1.A8
PWM 9: XP1.A9
PWM 10: XP1.A10
PWM 11: XP1.A11
PWM 12: XP1.A12
PWM 13: XP1.A13
PWM 14: XP1.A14
PWM 15: XP1.A15
PWM 16: XP1.A16
RX1_N: J2.14(RX_N_2) ; port USB3.0_1.RX_N
RX1_P: J2.15(RX_P_2) ; port USB3.0_1.RX_P
RX_N: J2.5(RX_N_1) ; port USB3.0.RX_N
RX_P: J2.6(RX_P_1) ; port USB3.0.RX_P
TX1_N: J2.17(TX_N_2) ; port USB3.0_1.TX_N
TX1_P: J2.18(TX_P_2) ; port USB3.0_1.TX_P
TX_N: J2.8(TX_N_1) ; port USB3.0.TX_N
TX_P: J2.9(TX_P_1) ; port USB3.0.TX_P
NetDD1_57: J3.05(CLK) ; port SD_CLK
NetDD1_61: J3.02(CD/DAT3) ; port SD_DAT3
NetDD1_62: J3.03(CMD) ; port SD_CMD
NetDD1_63: J3.07(DAT0) ; port SD_DAT0
NetDD1_67: J3.08(DAT1) ; port SD_DAT1
NetDD1_69: J3.01(DAT2) ; port SD_DAT2
NetDD1_102: J1.52(CLKREQ) ; port PCIe.PCIe_nCLKREQ
NetDD1_104: J1.54(PEWAKE) ; port PCIe.PCIe_nWAKE
NetDD1_109: J1.50(PERST) ; port PCIe_nRST
NetXP1_B11: XP1.B11 ; port UART2_Rx
NetXP1_B12: XP1.B12 ; port UART2_Tx
NetXP1_B13: XP1.B13 ; port I2C_SCL
NetXP1_B14: XP1.B14 ; port I2C_SDA

Not connected (* = marked no-connect by the designer): J1 5 6(NC)* 7 8(NC)* 10(LED) 11 13 17 19 20(NC)* 22(NC)* 23 24(NC)* 25 26(NC)* 28(NC)* 29 30(NC)* 31 32(NC)* 34(NC)* 35(PER_N_1) 36(NC)* 37(PER_P_1) 38(DEVSLP) 40(NC)* 42(NC)* 44(NC)* 46(NC)* 48(NC)* 56(NC)* 58(NC)* 67(NC)* 68(SUSCLK) 69(PEDET) S1(SHIELD) S2(SHIELD); XP1 B1 B2 B3 B4 B5 B6 B7 B8 B9 B10 B15 B16

### Buses and harness runs
bus PWM[1..16] = port PWM[1..16]

### Layout directives
differential pair: PCIe_CLK_N, PCIe_CLK_P, PCIe_RX_N, PCIe_RX_P, PCIe_TX_N, PCIe_TX_P

### Notes on the sheet
- ШИМ 1
- ШИМ 2
- ШИМ 3
- ШИМ 4
- ШИМ 5
- ШИМ 6
- ШИМ 7
- ШИМ 8
- ШИМ 9
- ШИМ 10
- ШИМ 11
- ШИМ 12
- ШИМ 13
- ШИМ 14
- ШИМ 15
- ШИМ 16
- ETH 1
- ETH 2
- ETH 3
- ETH 4
- ETH 5
- ETH 6
- ETH 7
- ETH 8
- ГА_P
- ГА_N
- Модем Tx
- Модем Rx
- I2C_SCL
- I2C_SDA
- Перв. примен.
- Справ. №
- Подп. и дата
- Инв. № дубл.
- Взам. инв. №
- Инв. № подл.
- Изм.
- Лист
- № докум.
- Подп.
- Дата
- Копировал
- Формат А2
- (in symbol DIN41612_32_2row_right_angle_father, part A) Конт; Цепь
- (in symbol DIN41612_32_2row_right_angle_father, part B) Конт; Цепь

### Library data of the parts
J1 = PCIe M2: PCIe M.2 Connectors, Storage and Server Connector, P=0.5mm, H=3.2mm, Key M,Gold Plating; MF: Amphenol; MP: MDT320M03001; SnapEDA_Link: https://www.snapeda.com/parts/MDT320M03001/Amphenol/view-part/?ref=snap; Package: None; Value: *; Check_prices: https://www.snapeda.com/parts/MDT320M03001/Amphenol/view-part/?ref=eda; Part Number: PCIe M2
J2 = USB_3.0: Двойной USB 3.0; MF: Stewart Connector; MP: SS-52000-003; SnapEDA_Link: https://www.snapeda.com/parts/SS-52000-003/Stewart+Connector/view-part/?ref=snap; Package: None; Value: *; Check_prices: https://www.snapeda.com/parts/SS-52000-003/Stewart+Connector/view-part/?ref=eda; Part Number: USB_3.0
J3 = MSD-10-C: å¾®åž‹ SD å¡è¿žæŽ¥å™¨ï¼Œ 8 ä½ï¼Œ è¿žæŽ¥å™¨ï¼Œ é“°é“¾å¼ï¼Œ è¡¨é¢è´´è£…ï¼Œ æ¿ä¸Šæ–¹ 1.9 mm é«˜åº¦ï¼Œ 15uâ€œé‡‘; MF: Same Sky; SnapEDA_Link: https://www.snapeda.com/parts/MSD-10-C/Same+Sky/view-part/?ref=snap; Package: None; Value: *; MP: MSD-10-C; Check_prices: https://www.snapeda.com/parts/MSD-10-C/Same+Sky/view-part/?ref=eda
XP1 = DIN41612_32_2row_right_angle_father: DIN41612R (DS1118-32M0R23), Разъем (вилка) тип B 32pin (2х16), шаг 2.54мм двухрядный угловой (ряд АВ); Part Number: DIN41612_32_2row_right_angle_father

## Nets that join several sheets
+3.3В_M2: Power (C5.2 L1.2 R1.1), Connectors (9 pins)
GND: Sheet1 (51 pins), Power (5 pins), ETH_SWITCH (C3.1 C4.2), Connectors (13 pins)
D1_N: Sheet1 (DD1.165), Connectors (J2.11)
D1_P: Sheet1 (DD1.163), Connectors (J2.12)
D_N: Sheet1 (DD1.136), Connectors (J2.2)
D_P: Sheet1 (DD1.134), Connectors (J2.3)
NetDD1_57: Sheet1 (DD1.57), Connectors (J3.05)
NetDD1_61: Sheet1 (DD1.61), Connectors (J3.02)
NetDD1_62: Sheet1 (DD1.62), Connectors (J3.03)
NetDD1_63: Sheet1 (DD1.63), Connectors (J3.07)
NetDD1_67: Sheet1 (DD1.67), Connectors (J3.08)
NetDD1_69: Sheet1 (DD1.69), Connectors (J3.01)
NetDD1_102: Sheet1 (DD1.102), Connectors (J1.52)
NetDD1_104: Sheet1 (DD1.104), Connectors (J1.54)
NetDD1_106: Sheet1 (DD1.106), Power (DD2.4)
NetDD1_109: Sheet1 (DD1.109), Connectors (J1.50)
PCIe_CLK_N: Sheet1 (DD1.112), Connectors (J1.55)
PCIe_CLK_P: Sheet1 (DD1.110), Connectors (J1.53)
PCIe_RX_N: Sheet1 (DD1.118), Connectors (J1.41)
PCIe_RX_P: Sheet1 (DD1.116), Connectors (J1.43)
PCIe_TX_N: Sheet1 (DD1.124), Connectors (J1.47)
PCIe_TX_P: Sheet1 (DD1.122), Connectors (J1.49)
RX1_N: Sheet1 (DD1.157), Connectors (J2.14)
RX1_P: Sheet1 (DD1.159), Connectors (J2.15)
RX_N: Sheet1 (DD1.128), Connectors (J2.5)
RX_P: Sheet1 (DD1.130), Connectors (J2.6)
TX1_N: Sheet1 (DD1.169), Connectors (J2.17)
TX1_P: Sheet1 (DD1.171), Connectors (J2.18)
TX_N: Sheet1 (DD1.140), Connectors (J2.8)
TX_P: Sheet1 (DD1.142), Connectors (J2.9)

## Assembly variants
01: all parts fitted